# EAGLE design USBasp_A (EAGLE 7.2.0)
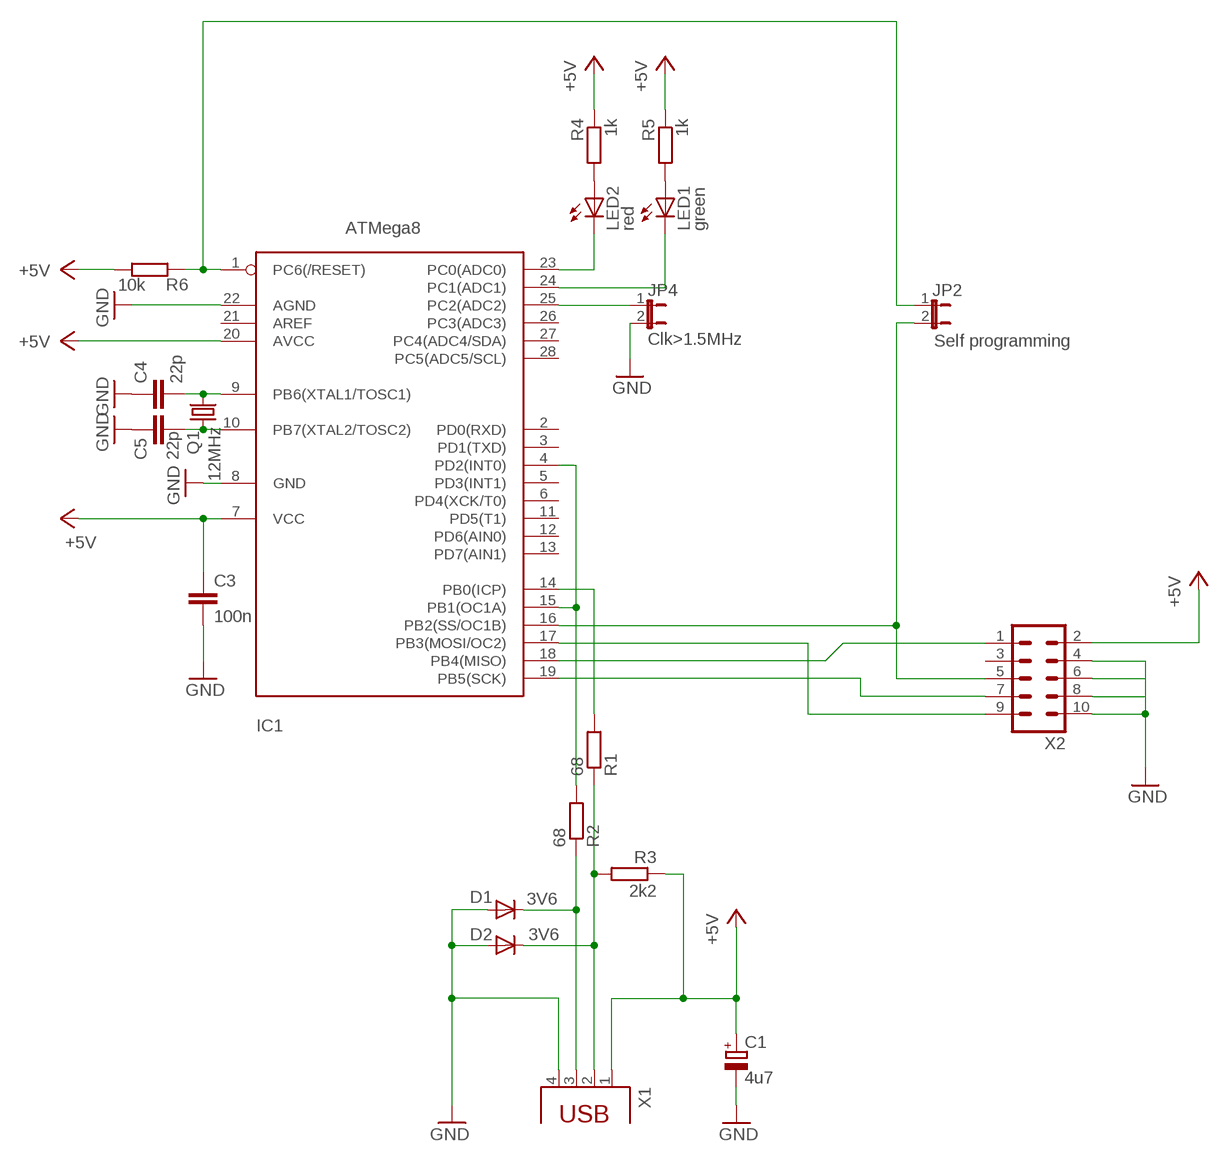
[diagram p0: schematic, sheet 1]

## Parts
C1  4u7  CPOL-EUE2.5-5  [E2,5-5]
C3  100n  C-EUC1206K  [C1206K]
C4  22p  C-EUC1206K  [C1206K]
C5  22p  C-EUC1206K  [C1206K]
D1  3V6  PMLL41SOD80C  [SOD80C]
D2  3V6  PMLL41SOD80C  [SOD80C]
IC1  ATMega8  MEGA8-P  [DIL28-3]
JP2  Self programming  JP1E  [JP1]
JP4  Clk>1.5MHz  JP1E  [JP1]
LED1  green  LED3MM  [LED3MM]
LED2  red  LED3MM  [LED3MM]
Q1  12MHz  CRYTALHC49S  [HC49/S]
R1  68  R-EU_R1206W  [R1206W]
R2  68  R-EU_R1206W  [R1206W]
R3  2k2  R-EU_R1206W  [R1206W]
R4  1k  R-EU_R1206W  [R1206W]
R5  1k  R-EU_R1206W  [R1206W]
R6  10k  R-EU_R1206W  [R1206W]
X1  PN87520  [PN87520]
X2  ML10  [ML10]

## Nets
+5V: C1.+ C3.1 IC1.7(VCC) IC1.20(AVCC) R3.1 R4.1 R5.1 R6.1 X1.1 X2.2
GND: C1.- C3.2 C4.1 C5.1 D1.A D2.A IC1.8(GND) IC1.22(AGND) JP4.2 X1.4 X2.4 X2.6 X2.8 X2.10
N$1: IC1.1(PC6(/RESET)) JP2.1 R6.2
N$2: IC1.16(PB2(SS/OC1B)) JP2.2 X2.5
N$3: IC1.17(PB3(MOSI/OC2)) X2.9
N$4: IC1.19(PB5(SCK)) X2.7
N$5: D2.C R1.1 R3.2 X1.2
N$7: IC1.4(PD2(INT0)) IC1.15(PB1(OC1A)) R2.2
N$8: D1.C R2.1 X1.3
N$13: LED2.A R4.2
N$14: IC1.23(PC0(ADC0)) LED2.K(C)
N$15: IC1.24(PC1(ADC1)) LED1.K(C)
N$16: IC1.14(PB0(ICP)) R1.2
N$22: C4.2 IC1.9(PB6(XTAL1/TOSC1)) Q1.2
N$23: C5.2 IC1.10(PB7(XTAL2/TOSC2)) Q1.1
N$24: IC1.25(PC2(ADC2)) JP4.1
N$25: LED1.A R5.2
N$26: IC1.18(PB4(MISO)) X2.1
Unconnected: IC1.2(PD0(RXD)) IC1.3(PD1(TXD)) IC1.5(PD3(INT1)) IC1.6(PD4(XCK/T0)) IC1.11(PD5(T1)) IC1.12(PD6(AIN0)) IC1.13(PD7(AIN1)) IC1.21(AREF) IC1.26(PC3(ADC3)) IC1.27(PC4(ADC4/SDA)) IC1.28(PC5(ADC5/SCL)) X2.3

## Library data of the parts
C1 = rcl:CPOL-EU: POLARIZED CAPACITOR, European symbol
C3-C5 = rcl:C-EU: CAPACITOR, European symbol
D1 D2 = diode:PMLL41*: High-speed diodes Source: http://www.semiconductors.philips.com/acrobat_download/datasheets/PMLL4150_2.pdf
IC1 = atmel:MEGA8-P: MICROCONTROLLER 8 Kbytes FLASH 1 kbytes SRAM 512 bytes EEPROM USART 4-channel 10 bit ADC 2-channel 8 bit ADC Source: avr.lbr
JP2 JP4 = jumper:JP1E: JUMPER
LED1 LED2 = led:LED: LED OSRAM: - CHIPLED LG R971, LG N971, LY N971, LG Q971, LY Q971, LO R971, LY R971 LH N974, LH R974 LS Q976, LO Q976, LY Q976 LO Q996 - Hyper CHIPLED LW Q18S LB Q993, LB Q99A, LB R99A - SideLED LS A670, LO A670, LY A670, LG A670, LP A670 LB A673, LV A673, LT A673, LW A673 LH A674 LY A675 LS A676, LA A676, LO A676, LY A676, LW A676 LS A679, LY A679, LG A679 - Hyper Micro SIDELED® LS Y876, LA Y876, LO Y876, LY Y876 LT Y87S - SmartLED LW L88C, LW L88S LB L89C, LB L89S, LG L890 LS L89K, LO L89K, LY L89K LS L896, LA L896, LO L896, LY L896 - TOPLED LS T670, LO T670, LY T670, LG T670, LP T670 LSG T670, LSP T670, LSY T670, LOP T670, LYG T670 LG T671, LOG T671, LSG T671 LB T673, LV T673, LT T673, LW T673 LH T674 LS T676, LA T676, LO T676, LY T676, LB T676, LH T676, LSB T676, LW T676 LB T67C, LV T67C, LT T67C, LS T67K, LO T67K, LY T67K, LW E67C LS E67B, LA E67B, LO E67B, LY E67B, LB E67C, LV E67C, LT E67C LW T67C LS T679, LY T679, LG T679 LS T770, LO T770, LY T770, LG T770, LP T770 LB T773, LV T773, LT T773, LW T773 LH T774 LS E675, LA E675, LY E675, LS T675 LS T776, LA T776, LO T776, LY T776, LB T776 LHGB T686 LT T68C, LB T68C - Hyper Mini TOPLED® LB M676 - Mini TOPLED Santana® LG M470 LS M47K, LO M47K, LY M47K Source: http://www.osram.convergy.de/
Q1 = crystal:CRYTAL: CRYSTAL
R1-R6 = rcl:R-EU_: RESISTOR, European symbol
X1 = con-berg:PN87520: BERG USB connector; OC_FARNELL: unknown; OC_NEWARK: unknown
X2 = con-harting-ml:ML10: HARTING; OC_FARNELL: unknown; OC_NEWARK: unknown

## Board
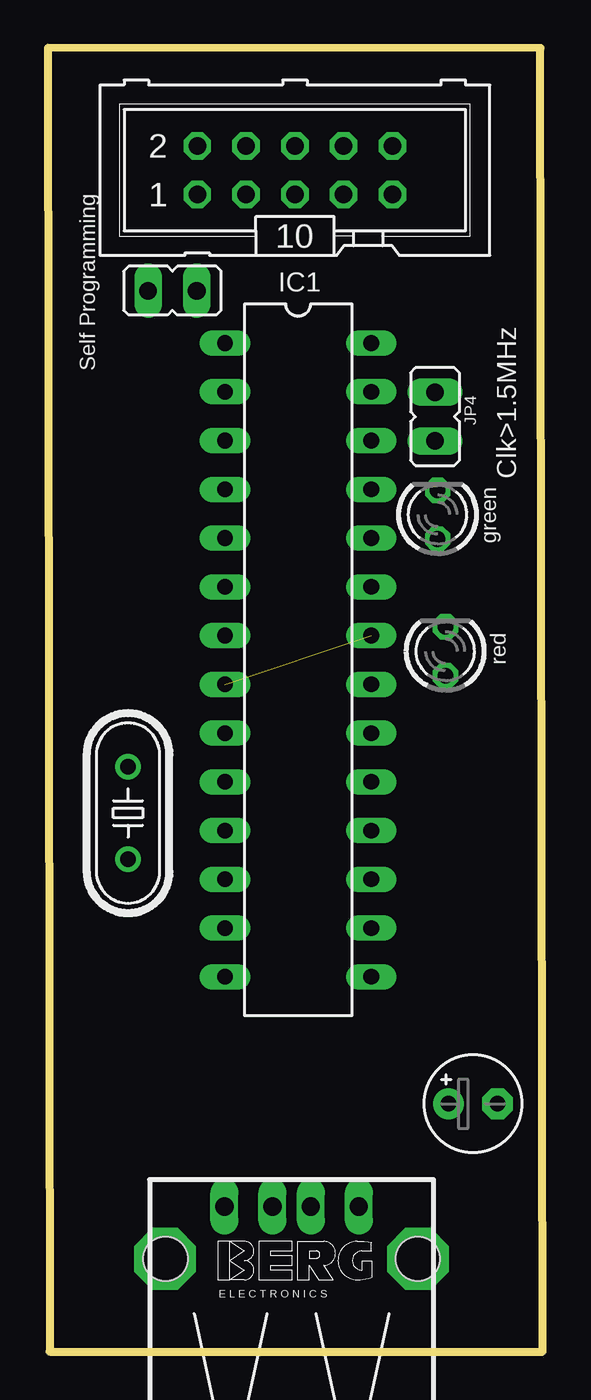
[diagram p1: board, top side]
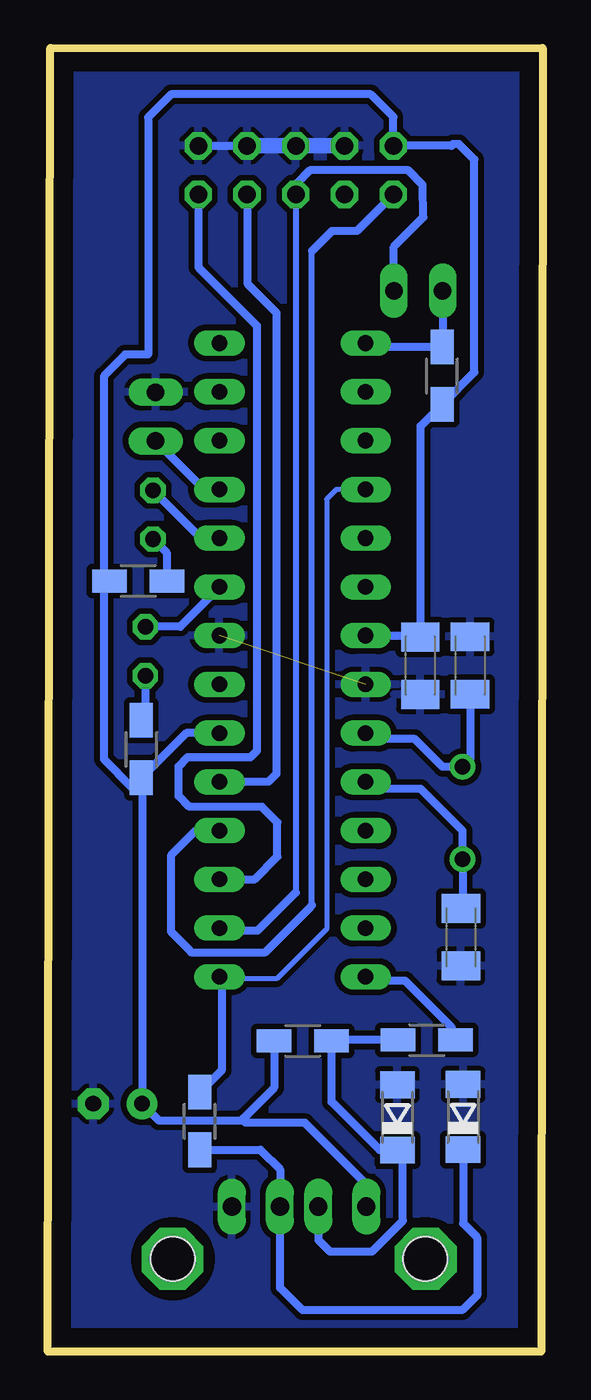
[diagram p2: board, bottom side, seen from below]

Size 25.77 x 67.93 mm. Coordinates in mm from the lower left corner, seen from the top.
Outline: 0,67.93 0.08,0 25.77,0 25.65,67.92 0,67.93
Copper layers (1*16): Top 0.035mm / dielectric 1.5mm / Bottom 0.035mm
Design rules "default": minimum track width 10mil, minimum drill 24mil, track to track 8mil, track to pad 8mil, pad to pad 8mil, via to via 8mil, smd to smd 8mil, copper to edge 40mil, drill to drill 8mil, minimum pad ring 10mil, minimum via ring 8mil, stop-mask expansion 4mil, vias tented up to drill 0mil, thermal gap 10mil

### Footprints (pad centres in the part's own frame; a part is rotated, then mirrored left to right if it is on the bottom)
E2,5-5 = drill 0.813 pad 1.6: + -1.27,0 | drill 0.813 pad 1.6 octagon: - 1.27,0
C1206K = smd 1.5 x 2: 1 -1.5,0; 2 1.5,0
SOD80C = smd 1.4 x 1.8: A 1.7,0; C -1.7,0
DIL28-3 = drill 0.813 long: 1 -16.51,-3.81; 2 -13.97,-3.81; 3 -11.43,-3.81; 4 -8.89,-3.81; 5 -6.35,-3.81; 6 -3.81,-3.81; 7 -1.27,-3.81; 8 1.27,-3.81; 9 3.81,-3.81; 10 6.35,-3.81; 11 8.89,-3.81; 12 11.43,-3.81; 13 13.97,-3.81; 14 16.51,-3.81; 15 16.51,3.81; 16 13.97,3.81; 17 11.43,3.81; 18 8.89,3.81; 19 6.35,3.81; 20 3.81,3.81; 21 1.27,3.81; 22 -1.27,3.81; 23 -3.81,3.81; 24 -6.35,3.81; 25 -8.89,3.81; 26 -11.43,3.81; 27 -13.97,3.81; 28 -16.51,3.81
JP1 = drill 0.914 long: 1 0,-1.27; 2 0,1.27
LED3MM = drill 0.813 octagon: A -1.27,0; K 1.27,0
HC49/S = drill 0.813: 1 -2.413,0; 2 2.413,0
R1206W = smd 1.8 x 1.2: 1 -1.499,0; 2 1.499,0
PN87520 = drill 0.95 long: 1 -3.5,2.71; 2 -1,2.71; 3 1,2.71; 4 3.5,2.71 | hole 2.3: -6.57,0; 6.57,0
ML10 = drill 0.914 octagon: 1 -5.08,-1.27; 2 -5.08,1.27; 3 -2.54,-1.27; 4 -2.54,1.27; 5 0,-1.27; 6 0,1.27; 7 2.54,-1.27; 8 2.54,1.27; 9 5.08,-1.27; 10 5.08,1.27

### Placement (x,y rotation side)
C1  22.14,12.91 0 top
C3  6.38,35.74 270 bottom
C4  3.78,35.75 270 bottom
C5  4.26,21.59 90 bottom
D1  4.14,12.22 90 bottom
D2  7.57,12.2 90 bottom
IC1  13.03,36.04 270 top
JP2  6.48,55.28 270 top
JP4  20.16,48.72 0 top
LED1  20.3,43.61 90 top
LED2  20.7,36.49 90 top
Q1  4.17,28.06 90 top
R1  6.03,16.23 0 bottom
R2  17.86,12.01 90 bottom
R3  12.49,16.19 0 bottom
R4  20.9,31.39 90 bottom
R5  21.06,40.16 0 bottom
R6  5.24,50.85 90 bottom
X1  12.69,4.84 0 top
X2  12.86,61.56 0 top

### Tracks (layer width: path | path; a pad name or v marks a point on that pad's centre or on a via)
+5V
  Bottom 0.305: 15.55,12.19 15.56,12.19
  Bottom 0.406: 22.86,40.12 22.86,50.82 21.76,51.92 21.76,51.96 20.56,51.96 20.56,64.32 19.36,65.52 8.96,65.52 7.78,64.34 X2.2 4.75,62.83 4.66,62.92 4.36,62.92 3.56,62.12 3.56,51.03 R6.1 6.36,48.23 6.36,37.31 6.56,37.31 | 22.86,40.12 22.86,30.87 21.39,29.41 | IC1.7 6.56,37.31 | C3.1 6.49,37.24 6.56,37.31 | 13.93,16.19 R3.1 13.99,13.75 15.55,12.19 | R5.1 22.82,40.16 22.86,40.12 | 21.39,29.41 R4.1 | R4.1 20.87,29.06 C1.+ 20,12.04 15.71,12.04 15.65,12.1 | 20.68,30.12 21.39,29.41 | 15.65,12.1 15.56,12.19 | X1.1 9.19,8.72 12.39,11.92 15.47,11.92 15.65,12.1 | IC1.20 18.56,32.23 R4.1
GND  (1 unrouted)
  Bottom 0.406: X2.10 X2.8
  Bottom 0.813: X2.4 X2.6 X2.8
  pour Bottom (isolate 0.305): -0.06,67.87 25.56,67.91 25.7,0.05 0.14,0.05
N$1
  Bottom 0.305: 9.46,52.79 IC1.1
  Bottom 0.406: IC1.1 9.02,52.35 R6.2 5.21,52.38 JP2.1
N$2
  Bottom 0.305: X2.5 12.86,23.92
  Bottom 0.406: 12.86,23.92 14.86,21.92 16.69,21.92 IC1.16 | JP2.2 7.75,57.57 6.22,59.1 6.26,60.78 7,61.55 12.13,61.56 12.83,60.83 X2.5
N$3
  Bottom 0.406: X2.9 17.94,56.5 14.88,53.44 14.88,31.31 15.22,30.97 18.5,30.97 18.97,30.5 18.97,28.95 18.41,28.39 14.63,28.39 13.82,27.58 13.82,25.79 15,24.61 IC1.17
N$4
  Bottom 0.406: IC1.19 14.29,29.69 13.86,30.12 13.86,54.12 15.36,55.62 15.36,60.25 X2.7
N$5
  Bottom 0.406: R1.1 10.95,16.23 R3.2 10.99,13 8.49,10.5 D2.C | X1.2 11.69,5.82 11.07,5.2 8.9,5.2 7.28,6.82 7.28,10.21 D2.C | 7.33,10.26 D2.C
N$7
  Bottom 0.254: IC1.4 10.75,44.93 11.26,44.42 11.26,22.02 13.86,19.42 16.73,19.42 IC1.15
  Bottom 0.406: 16.73,19.42 16.73,14.64 R2.2
N$8
  Bottom 0.406: R2.1 14.7,10.51 13.68,9.49 X1.3 13.68,3.32 12.51,2.15 4.2,2.15 3.42,2.93 3.42,5.95 4.14,6.67 D1.C
N$10  (via drill 2.2 pad 0.81)
  other vias: 19.28,4.83
N$13
  Bottom 0.406: LED2.A 20.72,32.39 R4.2
N$14
  Bottom 0.406: IC1.23 17.03,39.85 17.03,39.62 18.88,37.77 LED2.K
N$15
  Bottom 0.406: IC1.24 17.81,42.39 LED1.K
N$16
  Bottom 0.406: IC1.14 9.01,19.32 7.16,19.32 4.74,16.9 4.74,16.44 R1.2
N$18  (via drill 2.2 pad 0.81)
  other vias: 6.09,4.83
N$22
  Bottom 0.406: IC1.9 8.91,31.92 6.66,31.92 5.21,30.47 Q1.2 3.78,30.86 C4.2
N$23
  Bottom 0.406: C5.2 4.17,23.18 Q1.1 4.17,27.13 6.36,29.32 8.85,29.32 IC1.10
N$24
  Bottom 0.406: IC1.25 17.64,44.93 JP4.1
N$25
  Bottom 0.406: R5.2 19.56,41.6 LED1.A
N$26
  Bottom 0.305: 12.02,23.25 12.02,57.35
  Bottom 0.406: IC1.18 18.07,27.15 19.37,25.85 19.37,21.88 18.38,20.89 18.38,20.86 18.32,20.8 14.45,20.8 12.09,23.16 12.09,23.18 12.02,23.25 | 12.02,57.35 10.97,58.4 9.67,58.4 X2.1

### Text on the board
tPlace: Self Programming